# Altium project Bluetooth_Sentinel.PrjPcb
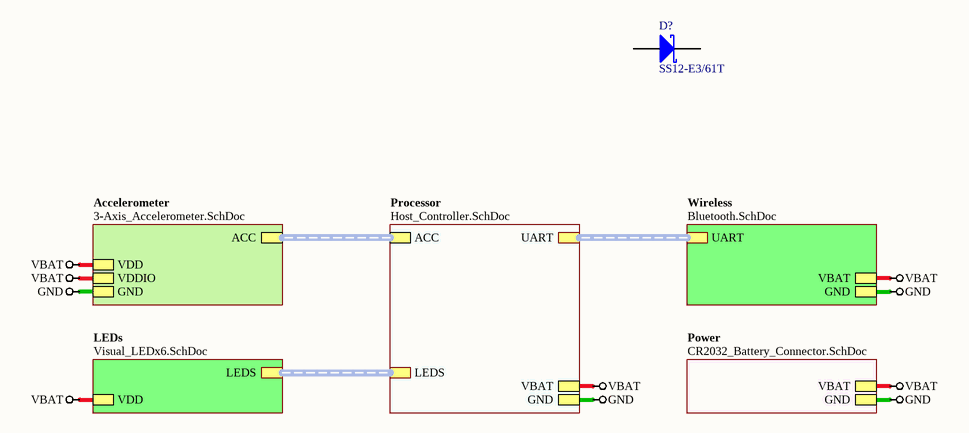
[diagram p0: Bluetooth_Sentinel.SchDoc]
1 sheet, 1 parts. Net scope: hierarchical (ports join the sheet entries above them; power ports are global).
Board files: Bluetooth_Sentinel.PcbDoc, compare for.PcbDoc

## Sheet Bluetooth_Sentinel.SchDoc: Bluetooth Sentinel
size A4

### Parts
D?  SS12-E3/61T  [VISH-DO-214AC_V]

### Sub-sheets
Accelerometer = 3-Axis_Accelerometer.SchDoc (file not in this document): VDD, VDDIO, GND, ACC (harness SPI_LIS331)
LEDs = Visual_LEDx6.SchDoc (file not in this document): VDD, LEDS (harness LEDx6)
Power = CR2032_Battery_Connector.SchDoc (file not in this document): VBAT, GND
Processor = Host_Controller.SchDoc (file not in this document): UART (harness UART_HS), LEDS (harness LEDx6), VBAT, GND, ACC (harness SPI_LIS331)
Wireless = Bluetooth.SchDoc (file not in this document): UART (harness UART_HS), VBAT, GND

### Nets
GND: sheet Power/GND, sheet Wireless/GND, sheet Processor/GND, sheet Accelerometer/GND
VBAT: sheet Power/VBAT, sheet LEDs/VDD, sheet Wireless/VBAT, sheet Processor/VBAT, sheet Accelerometer/VDD, sheet Accelerometer/VDDIO

Not connected (* = marked no-connect by the designer): D? 1(A) 2(K)

### Buses and harness runs
harness sheet Accelerometer/ACC = sheet Processor/ACC
harness sheet LEDs/LEDS = sheet Processor/LEDS
harness sheet Processor/UART = sheet Wireless/UART

### Notes on the sheet
- Sheet Title
- Project Title
- Size:
- Date:
- A4
- Item:
- Time:
- Revision:
- Sheet
- of
- File:

### Library data of the parts
D? = CMP-004-00017-1: Schottky Barrier Rectifier, 20 V, 1 A, -65 to 150 degC, 2-Pin DO-214AC (SMA), RoHS, Tape and Reel; Manufacturer: Vishay Semiconductor; Max Surge Current: 40A; Forward Voltage: 5dV; Forward Current: 1A; Peak Reverse Current: 6mA; Package Quantity: 1800; Datasheet URL: http://www.vishay.com/docs/88746/ss12.pdf; Case/Package: SMA; Package Description: 2-Pin Surface Mount Device, Body 4.245 x 2.665 mm; Pins: 2; Mounting Technology: SM; Min Operating Temperature: -65°C; Packaging: TapeandReel; Datasheet Version: Aug-15; Manufacturer URL: http://www.vishay.com/; RoHS Compliant: True; Package Reference: DO-214AC (SMA); Max Operating Temperature: 125°C